# EAGLE design KeyChaininoTHT (EAGLE 6.1)
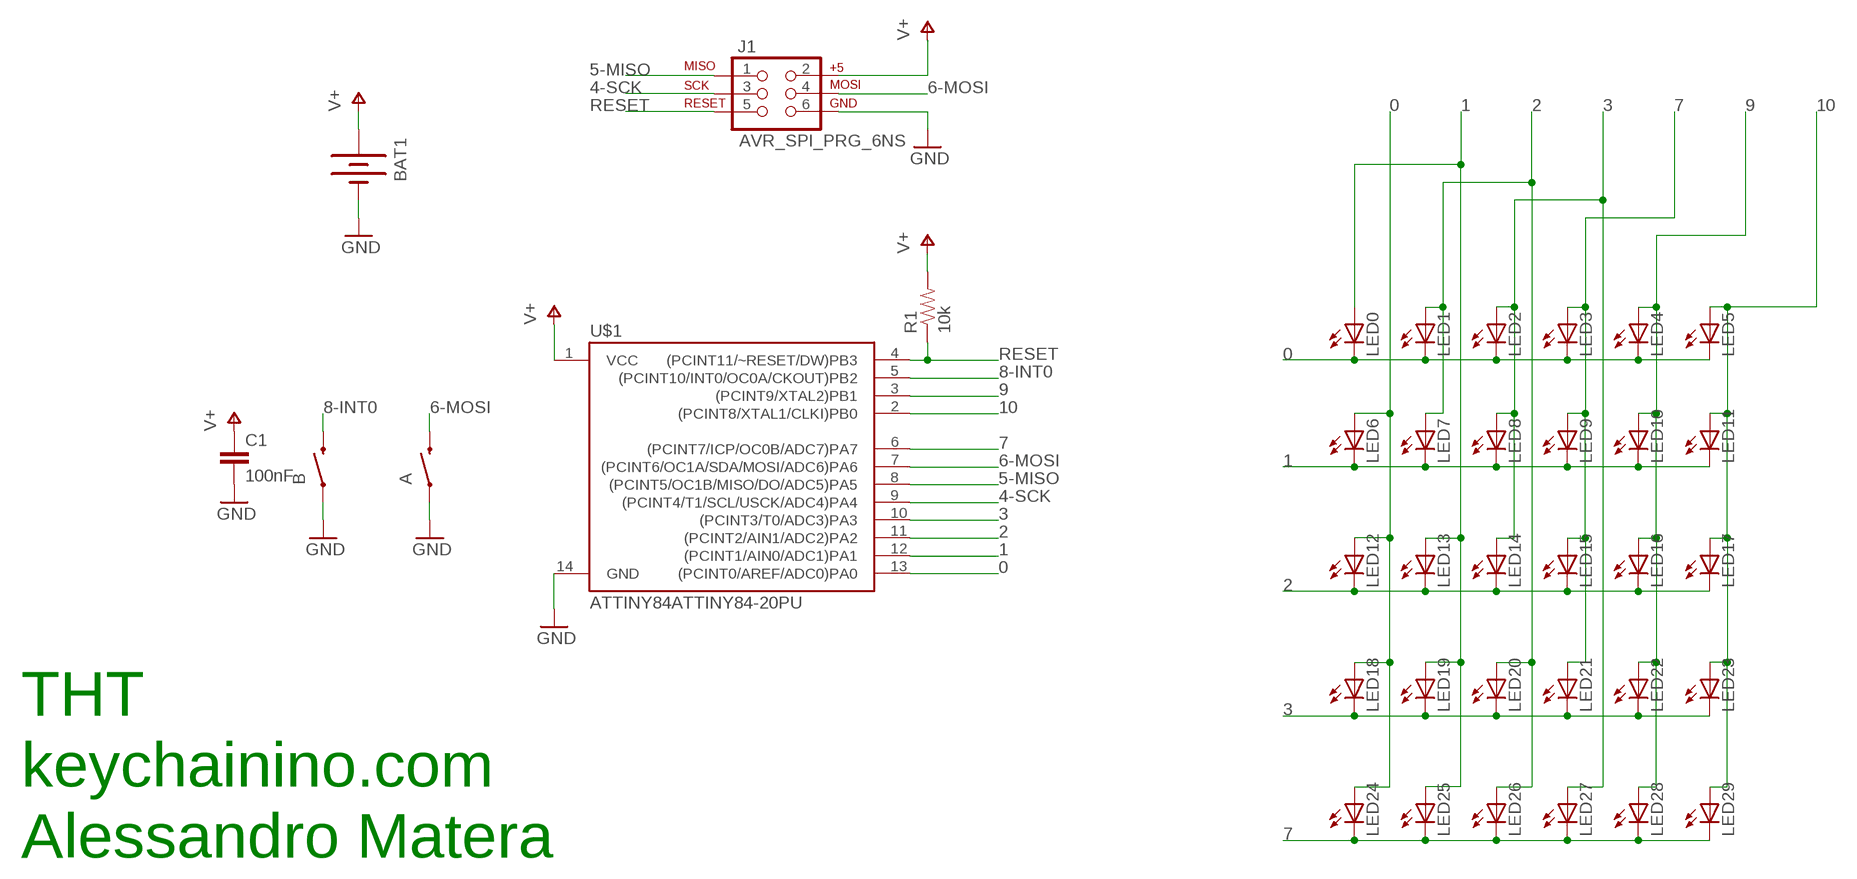
[diagram p0: schematic, sheet 1]

## Parts
A  SWITCH-MOMENTARY-2PTH  [TACTILE-PTH]
B  SWITCH-MOMENTARY-2PTH  [TACTILE-PTH]
BAT1  BATTERY20PTH  [BATTCOM_20MM_PTH]
C1  100nF  CAPKIT  [CAP-PTH-SMALL-KIT]
J1  AVR_SPI_PRG_6NS  [2X3-NS]
LED0  LED3MM  [LED3MM]
LED1  LED3MM  [LED3MM]
LED2  LED3MM  [LED3MM]
LED3  LED3MM  [LED3MM]
LED4  LED3MM  [LED3MM]
LED5  LED3MM  [LED3MM]
LED6  LED3MM  [LED3MM]
LED7  LED3MM  [LED3MM]
LED8  LED3MM  [LED3MM]
LED9  LED3MM  [LED3MM]
LED10  LED3MM  [LED3MM]
LED11  LED3MM  [LED3MM]
LED12  LED3MM  [LED3MM]
LED13  LED3MM  [LED3MM]
LED14  LED3MM  [LED3MM]
LED15  LED3MM  [LED3MM]
LED16  LED3MM  [LED3MM]
LED17  LED3MM  [LED3MM]
LED18  LED3MM  [LED3MM]
LED19  LED3MM  [LED3MM]
LED20  LED3MM  [LED3MM]
LED21  LED3MM  [LED3MM]
LED22  LED3MM  [LED3MM]
LED23  LED3MM  [LED3MM]
LED24  LED3MM  [LED3MM]
LED25  LED3MM  [LED3MM]
LED26  LED3MM  [LED3MM]
LED27  LED3MM  [LED3MM]
LED28  LED3MM  [LED3MM]
LED29  LED3MM  [LED3MM]
R1  10k  RESISTORKIT  [AXIAL-0.3-KIT]
U$1  ATTINY84ATTINY84-20PU  [DIL14]

## Nets
0: LED0.K(C) LED1.K(C) LED2.K(C) LED3.K(C) LED4.K(C) LED5.K(C) LED6.A LED12.A LED18.A LED24.A U$1.13((PCINT0/AREF/ADC0)PA0)
1: LED0.A LED6.K(C) LED7.K(C) LED8.K(C) LED9.K(C) LED10.K(C) LED11.K(C) LED13.A LED19.A LED25.A U$1.12((PCINT1/AIN0/ADC1)PA1)
2: LED1.A LED7.A LED12.K(C) LED13.K(C) LED14.K(C) LED15.K(C) LED16.K(C) LED17.K(C) LED20.A LED26.A U$1.11((PCINT2/AIN1/ADC2)PA2)
3: LED2.A LED8.A LED14.A LED18.K(C) LED19.K(C) LED20.K(C) LED21.K(C) LED22.K(C) LED23.K(C) LED27.A U$1.10((PCINT3/T0/ADC3)PA3)
4-SCK: J1.3 U$1.9((PCINT4/T1/SCL/USCK/ADC4)PA4)
5-MISO: J1.1 U$1.8((PCINT5/OC1B/MISO/DO/ADC5)PA5)
6-MOSI: A.3 J1.4 U$1.7((PCINT6/OC1A/SDA/MOSI/ADC6)PA6)
7: LED3.A LED9.A LED15.A LED21.A LED24.K(C) LED25.K(C) LED26.K(C) LED27.K(C) LED28.K(C) LED29.K(C) U$1.6((PCINT7/ICP/OC0B/ADC7)PA7)
8-INT0: B.3 U$1.5((PCINT10/INT0/OC0A/CKOUT)PB2)
9: LED4.A LED10.A LED16.A LED22.A LED28.A U$1.3((PCINT9/XTAL2)PB1)
10: LED5.A LED11.A LED17.A LED23.A LED29.A U$1.2((PCINT8/XTAL1/CLKI)PB0)
GND: A.1 B.1 BAT1.2(-) C1.2 J1.6 U$1.14(GND)
RESET: J1.5 R1.P$1 U$1.4((PCINT11/~RESET/DW)PB3)
V+: BAT1.1(+) C1.1 J1.2 R1.P$2 U$1.1(VCC)

## Notes on the sheet
- THT
- keychainino.com
- Alessandro Matera

## Library data of the parts
A B = SparkFun-Electromechanical:SWITCH-MOMENTARY-2: Various NO switches- pushbuttons, reed, etc
BAT1 = SparkFun-Electromechanical:BATTERY: Battery Holders Various common sizes : AA, AAA, 20mm coin cell and 12mm coin cell. 20MM_4LEGS, BATT-10373
C1 = SparkFun-Passives:CAP: Capacitor Standard 0603 ceramic capacitor, and 0.1" leaded capacitor.
J1 = SparkFun-Connectors:AVR_SPI_PRG_6: AVR ISP 6 Pin This is the reduced ISP connector for AVR programming. Common on Arduino. This footprint will take up less PCB space and can be used with a 10-pin to 6-pin adapter such as SKU: BOB-08508
LED0 LED1-LED29 = SparkFun-LED:LED: LEDs Standard schematic elements and footprints for 5mm, 3mm, 1206, and 0603 sized LEDs. 5mm - Spark Fun Electronics SKU : COM-00529 (and others)
R1 = SparkFun-Passives:RESISTOR: Resistor Basic schematic elements and footprints for 0603, 1206, and PTH resistors.
U$1 = SparkFun-DigitalIC:ATTINY84: Atmel 14-pin 2/4/8kB flash uC

## Board
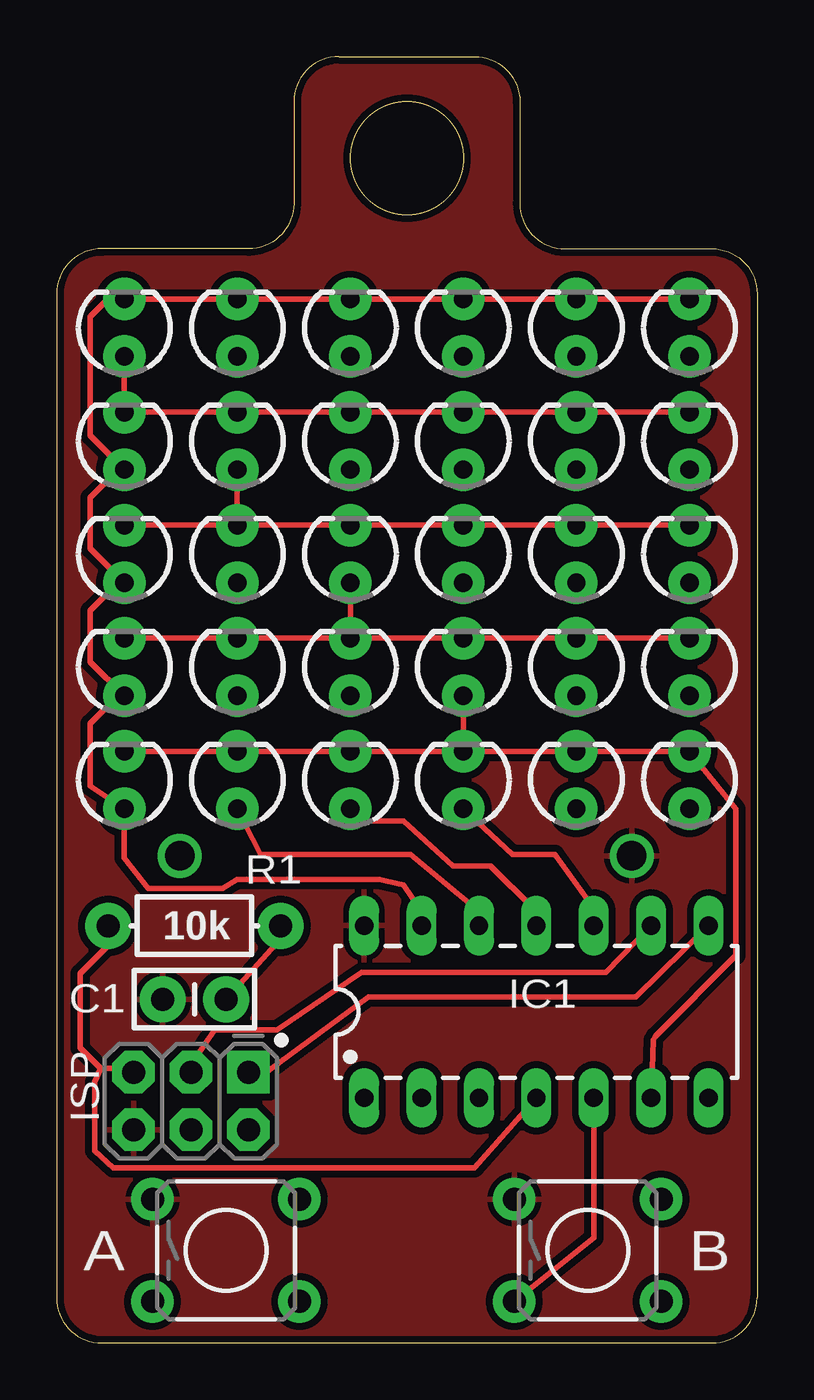
[diagram p1: board, top side]
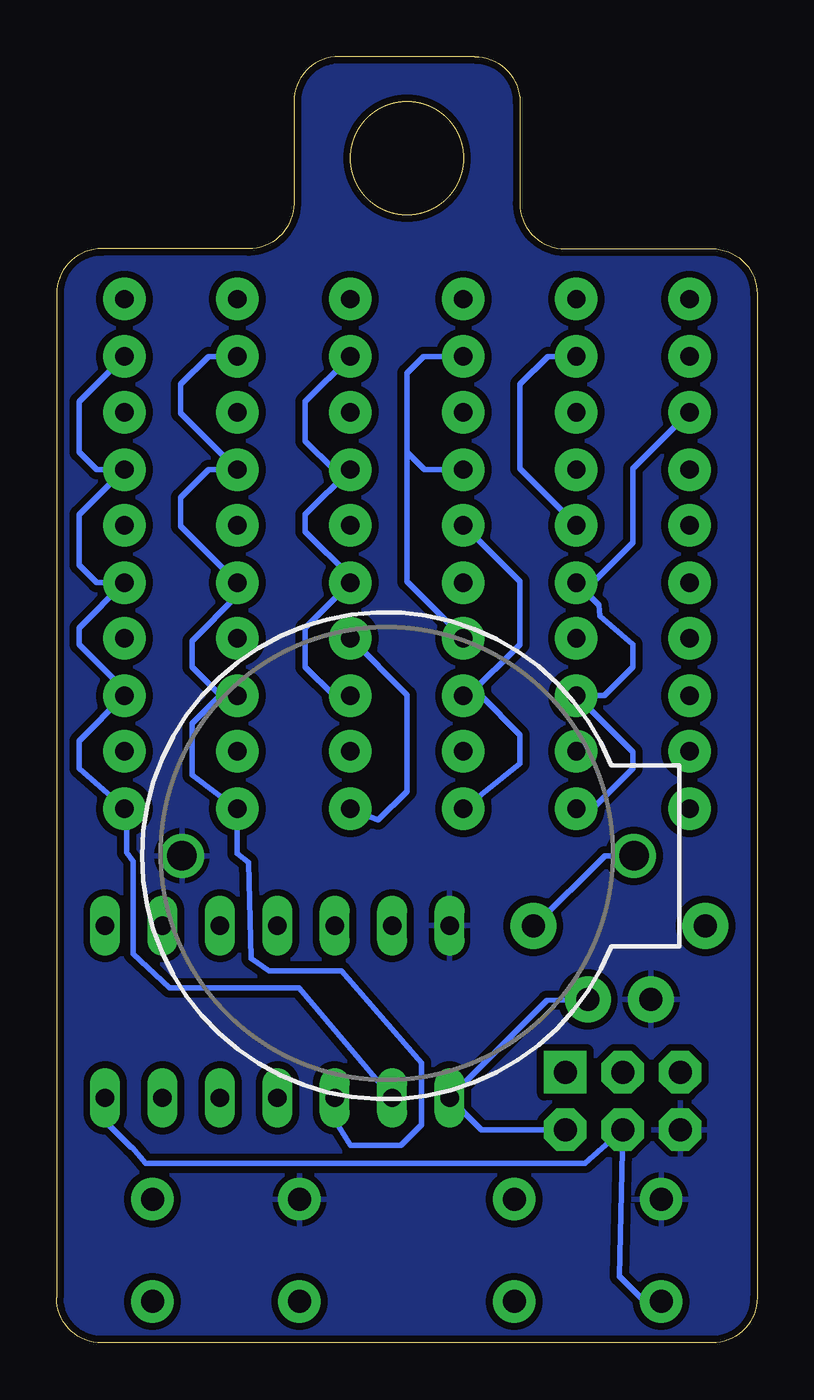
[diagram p2: board, bottom side, seen from below]

Size 31 x 56.9 mm. Coordinates in mm from the lower left corner, seen from the top.
Outline: 0,46.4 0,2 arc90 2,0 29,0 arc90 31,2 31,46.4 arc90 29,48.4 22.5,48.4 arc-90 20.5,50.4 20.5,54.9 arc90 18.5,56.9 12.5,56.9 arc90 10.5,54.9 10.5,50.4 arc-90 8.5,48.4 2,48.4 arc90 0,46.4
Outline: circle at 15.5,52.4 radius 2.5
Copper layers (1*16): Top 0.035mm / dielectric 1.5mm / Bottom 0.035mm
Design rules: minimum track width 6mil, minimum drill 12mil, track to track 6mil, track to pad 6mil, pad to pad 6mil, via to via 6mil, smd to smd 0mil, copper to edge 10mil, drill to drill 10mil, minimum pad ring 10mil, minimum via ring 6mil, stop-mask expansion 2mil, vias tented up to drill 100mil, thermal gap 10mil

### Footprints (pad centres in the part's own frame; a part is rotated, then mirrored left to right if it is on the bottom)
TACTILE-PTH = drill 1.016 pad 1.88: 1 -3.251,2.261; 2 3.251,2.261; 3 -3.251,-2.261; 4 3.251,-2.261
BATTCOM_20MM_PTH = drill 1.3: 1 20,0; 2 0,0
CAP-PTH-SMALL-KIT = drill 1.016 pad 2.032: 1 -1.397,0; 2 1.397,0
2X3-NS = drill 1.016 pad 1.88 square: 1 -2.54,-1.27 | drill 1.016 pad 1.88 octagon: 2 -2.54,1.27; 3 0,-1.27; 4 0,1.27; 5 2.54,-1.27; 6 2.54,1.27
LED3MM = drill 0.813 pad 1.88: A -1.27,0; K 1.27,0
AXIAL-0.3-KIT = drill 1.016 pad 2.032: P$1 -3.81,0; P$2 3.81,0
DIL14 = drill 0.813 long: 1 -8.89,-3.81; 2 -6.35,-3.81; 3 -3.81,-3.81; 4 -1.27,-3.81; 5 1.27,-3.81; 6 3.81,-3.81; 7 6.35,-3.81; 8 6.35,3.81; 9 3.81,3.81; 10 1.27,3.81; 11 -1.27,3.81; 12 -3.81,3.81; 13 -6.35,3.81; 14 -8.89,3.81

### Placement (x,y rotation side)
A  7.5,4.1 0 top
B  23.5,4.1 0 top
BAT1  25.45,21.55 0 bottom
C1  6.1,15.2 180 top
J1  5.95,10.7 180 top
LED0  3,44.9 90 top
LED1  8,44.9 90 top
LED2  13,44.9 90 top
LED3  18,44.9 90 top
LED4  23,44.9 90 top
LED5  28,44.9 90 top
LED6  3,39.9 90 top
LED7  8,39.9 90 top
LED8  13,39.9 90 top
LED9  18,39.9 90 top
LED10  23,39.9 90 top
LED11  28,39.9 90 top
LED12  3,34.9 90 top
LED13  8,34.9 90 top
LED14  13,34.9 90 top
LED15  18,34.9 90 top
LED16  23,34.9 90 top
LED17  28,34.9 90 top
LED18  3,29.9 90 top
LED19  8,29.9 90 top
LED20  13,29.9 90 top
LED21  18,29.9 90 top
LED22  23,29.9 90 top
LED23  28,29.9 90 top
LED24  3,24.9 90 top
LED25  8,24.9 90 top
LED26  13,24.9 90 top
LED27  18,24.9 90 top
LED28  23,24.9 90 top
LED29  28,24.9 90 top
R1  6.1,18.45 0 top
U$1  22.5,14.65 0 top

### Tracks (layer width: path | path; a pad name or v marks a point on that pad's centre or on a via)
0
  Top 0.254: LED5.K LED4.K LED3.K LED2.K LED1.K LED0.K 2.27,46.17 1.5,45.4 1.5,40.13 LED6.A 2.73,38.63 1.5,37.4 1.5,35.13 LED12.A 2.73,33.63 1.5,32.4 1.5,30.13 LED18.A 2.73,28.63 1.5,27.4 1.5,24.63 LED24.A 3,21.45 4.05,20.1 7.35,20.1 8,20.5 14.3,20.5 15.35,20.25 16.1,19.15 16.1,19.16 U$1.13
1
  Top 0.254: LED11.K LED10.K LED9.K LED8.K LED7.K LED6.K LED0.A | U$1.12 18.54,19.21 15.65,21.6 9.03,21.6 LED25.A
  Bottom 0.254: LED25.A 7.77,23.13 5.5,25.4 5.5,26.13 LED19.A 6.77,28.63 5.5,29.9 5.5,30.9 6.95,32.15 7,32.63 LED13.A 7.27,33.63 5.5,35.4 5.5,38.67 LED6.K
2
  Top 0.254: LED12.K LED13.K | LED13.K LED14.K LED15.K LED16.K LED17.K | LED7.A LED13.K | U$1.11 21.09,19.21 19.2,21.1 17.55,21.1 15.35,23.1 13.43,23.1 LED26.A
  Bottom 0.254: LED1.A 9.27,43.63 10.5,42.4 10.5,38.67 LED13.K | LED14.K 10.5,33.67 10.5,30.9 12.77,28.63 LED20.A 12.23,28.63 10.5,26.9 10.5,25.63 LED26.A
3
  Top 0.254: LED18.K LED19.K LED20.K 13.5,31.17 | 13.5,31.17 LED21.K LED22.K LED23.K | LED14.A 13,31.67 13.5,31.17 | U$1.10 23.77,19.23 22.05,21.6 20.18,21.6 LED27.A
  Bottom 0.254: LED2.A 14.77,43.63 15.5,42.9 15.5,39.4 | 15.5,39.4 15.5,33.67 LED20.K | LED8.A 14.73,38.63 15.5,39.4 | LED27.A 16.77,23.13 15.5,24.4 15.5,28.67 LED21.K
4-SCK
  Top 0.254: J1.3 6.15,12.6 7,13.85 9.75,13.85 13.5,16.4 24.3,16.4 U$1.9
5-MISO
  Top 0.254: J1.1 9.42,12.07 13.8,15.3 25.64,15.3 U$1.8
6-MOSI
  Bottom 0.254: A.3 4.29,1.14 6.1,2.95 J1.4 7.63,7.95 27.05,7.95 27.65,8.65 27.7,8.65 28.85,9.8 U$1.7
7
  Top 0.254: LED24.K LED25.K LED26.K LED27.K | LED27.K LED28.K LED29.K 30.05,23.62 30.05,17.15 26.5,13.55 26.41,13.41 U$1.6 | LED21.A LED27.K
  Bottom 0.254: LED21.A 18.73,28.63 20,29.9 20,31.63 LED15.A 18,33.9 20,35.9 20,36.63 LED9.A 18.73,38.63 20,39.9 20,41.63 LED3.A
8-INT0
  Top 0.254: U$1.5 23.77,4.66 B.3
9
  Bottom 0.254: LED4.A 24.27,43.63 25.5,42.4 25.5,41.13 LED10.A 24.27,38.63 25.5,37.4 25.5,36.13 LED16.A 23,33.05 25,31.05 25,29.9 23.5,28.4 23.23,28.4 LED22.A 23.77,28.63 25,27.4 25,25.13 LED28.A 23,21.65 22.5,21.25 22.4,17 21.6,16.45 18.4,16.45 14.85,12.4 14.85,9.65 15.75,8.75 18,8.75 18.65,9.8 18.65,11.55 U$1.3
10
  Bottom 0.254: LED5.A 30,41.63 30,39.4 29.23,38.63 LED11.A 30,36.63 30,34.4 29.23,33.63 LED17.A 30,31.63 30,30.9 28,28.9 LED23.A 30,26.63 30,25.4 28.2,23.85 LED29.A 27.9,23.53 27.9,21.7 27.6,21.3 27.6,17.2 26,15.7 20.26,15.7 U$1.2
GND
  pour Top (isolate 0.305): 41.85,-11.05 42.25,59.5 -8.1,59.5 -8.5,-11.75
  pour Bottom (isolate 0.305): 39.85,-9.05 39.75,59 -10.6,59 -10.5,-9.75
RESET
  Top 0.254: U$1.4 18.49,7.75 2.5,7.75 1.7,8.5 1.7,11.55 1.95,12.15 | R1.P$1 2.29,17.59 1.05,16.35 1.05,13.05 1.95,12.15 | J1.5 3.45,12.01 3.45,12.05 3.35,12.05 3.25,12.15 1.95,12.15
V+
  Top 0.254: R1.P$2 10.31,18.31 C1.1
  Bottom 0.254: BAT1.1 6.75,21.55 9.85,18.45 R1.P$2 | C1.1 9.3,15.15 U$1.1 12.2,9.43 J1.2

### Text on the board
tPlace: R1 | C1 | IC1 | ISP | A | B